# EAGLE design inverter (EAGLE 6.6.0)
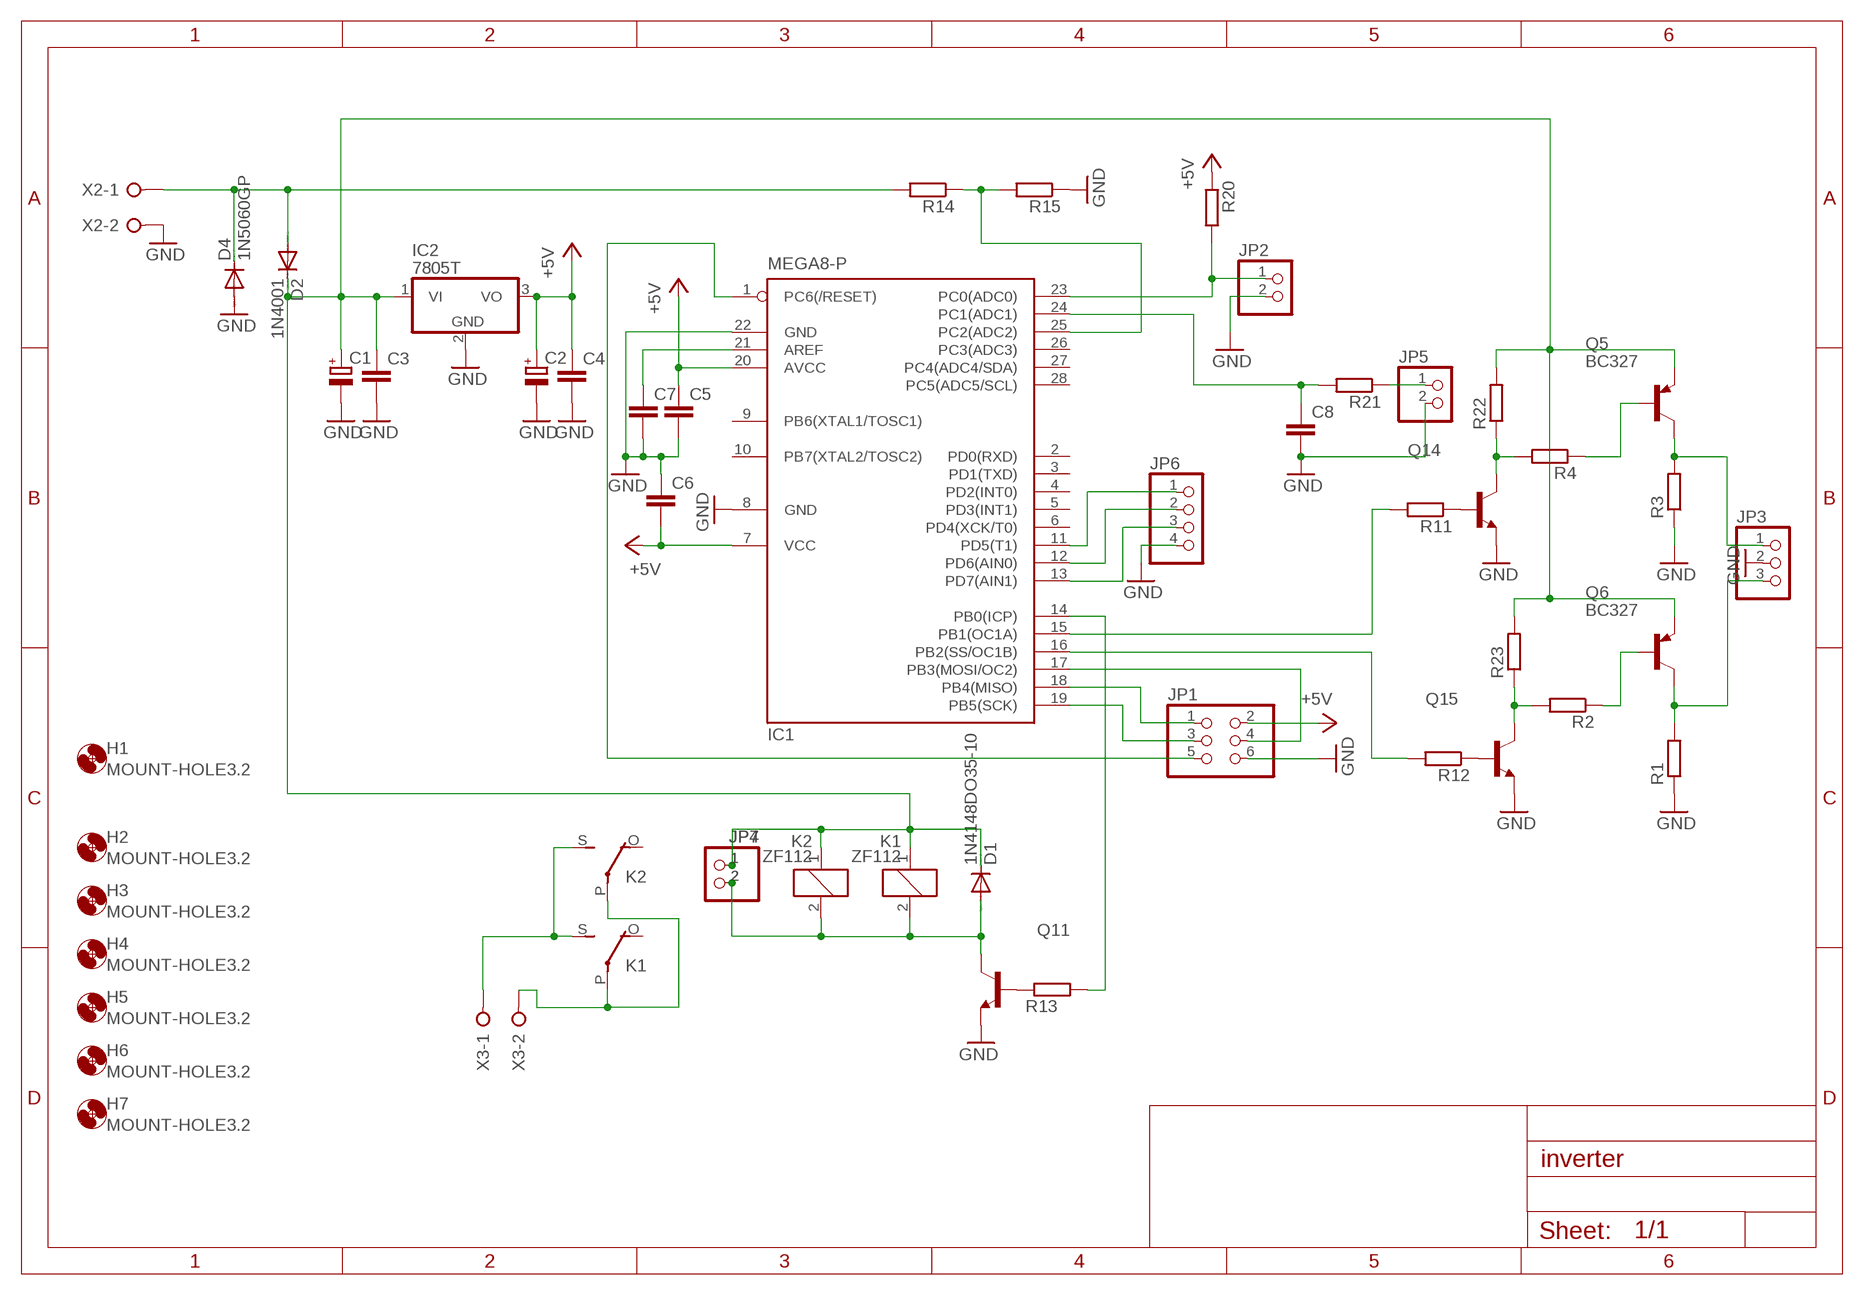
[diagram p0: schematic, sheet 1]

## Parts
C1  CPOL-EUE7.5-16  [E7,5-16]
C2  CPOL-EUE2.5-6  [E2,5-6]
C3  C-EU050-025X075  [C050-025X075]
C4  C-EU050-025X075  [C050-025X075]
C5  C-EU050-025X075  [C050-025X075]
C6  C-EU050-025X075  [C050-025X075]
C7  C-EU050-025X075  [C050-025X075]
C8  C-EU050-025X075  [C050-025X075]
D1  1N4148DO35-10  [DO35-10]
D2  1N4001  1N4148DO35-10  [DO35-10]
D4  1N5060GP  [DO15-12]
H1  MOUNT-HOLE3.2  [3,2]
H2  MOUNT-HOLE3.2  [3,2]
H3  MOUNT-HOLE3.2  [3,2]
H4  MOUNT-HOLE3.2  [3,2]
H5  MOUNT-HOLE3.2  [3,2]
H6  MOUNT-HOLE3.2  [3,2]
H7  MOUNT-HOLE3.2  [3,2]
IC1  MEGA8-P  [DIL28-3]
IC2  7805T  [TO220H]
JP1  PINHD-2X3  [2X03]
JP2  PINHD-1X2  [1X02]
JP3  PINHD-1X3  [1X03]
JP4  PINHD-1X2  [1X02]
JP5  PINHD-1X2  [1X02]
JP6  PINHD-1X4  [1X04]
JP7  PINHD-1X2  [1X02]
K1  ZF112  [ZF112]
K2  ZF112  [ZF112]
Q5  BC327  [TO92-EBC]
Q6  BC327  [TO92-EBC]
Q11  BC547-NPN-TO92-CBE  [TO92-CBE]
Q14  BC547-NPN-TO92-CBE  [TO92-CBE]
Q15  BC547-NPN-TO92-CBE  [TO92-CBE]
R1  R-EU_0207/5V  [0207/5V]
R2  R-EU_0207/2V  [0207/2V]
R3  R-EU_0207/5V  [0207/5V]
R4  R-EU_0207/2V  [0207/2V]
R11  R-EU_0207/5V  [0207/5V]
R12  R-EU_0207/5V  [0207/5V]
R13  R-EU_0207/2V  [0207/2V]
R14  R-EU_0207/10  [0207/10]
R15  R-EU_0207/10  [0207/10]
R20  R-EU_0207/10  [0207/10]
R21  R-EU_0207/2V  [0207/2V]
R22  R-EU_0207/10  [0207/10]
R23  R-EU_0207/10  [0207/10]
X2  W237-02P  [W237-132]
X3  W237-02P  [W237-132]

## Nets
+5V: C2.+ C4.1 C5.1 C6.2 IC1.7(VCC) IC1.20(AVCC) IC2.3(VO) JP1.2 R20.1
GND: C1.- C2.- C3.2 C4.2 C5.2 C6.1 C7.2 C8.2 D4.A IC1.8(GND) IC1.22(GND) IC2.2(GND) JP1.6 JP2.2 JP3.2 JP5.2 JP6.4 Q11.E Q14.E Q15.E R1.1 R3.1 R15.1 X2.2
N$1: JP5.1 R21.1
N$2: Q6.B R2.1
N$3: Q5.B R4.1
N$6: JP3.1 Q5.C R3.2
N$9: IC1.25(PC2(ADC2)) R14.1 R15.2
N$10: IC1.13(PD7(AIN1)) JP6.3
N$13: JP3.3 Q6.C R1.2
N$19: Q15.C R2.2 R23.1
N$20: Q15.B R12.1
N$21: IC1.15(PB1(OC1A)) R11.2
N$22: IC1.16(PB2(SS/OC1B)) R12.2
N$24: C7.1 IC1.21(AREF)
N$25: D2.A D4.C R14.2 X2.1
N$26: C1.+ C3.1 D1.C D2.C IC2.1(VI) JP4.1 JP7.1 K1.1 K2.1 Q5.E Q6.E R22.2 R23.2
N$27: C8.1 IC1.24(PC1(ADC1)) R21.2
N$28: D1.A JP4.2 JP7.2 K1.2 K2.2 Q11.C
N$30: Q11.B R13.1
N$31: K1.P(2:P) K2.P(2:P) X3.2
N$33: IC1.12(PD6(AIN0)) JP6.2
N$34: IC1.18(PB4(MISO)) JP1.1
N$35: IC1.19(PB5(SCK)) JP1.3
N$36: IC1.17(PB3(MOSI/OC2)) JP1.4
N$37: IC1.1(PC6(/RESET)) JP1.5
N$38: IC1.11(PD5(T1)) JP6.1
N$39: K1.S(2:S) K2.S(2:S) X3.1
N$40: Q14.B R11.1
N$41: IC1.23(PC0(ADC0)) JP2.1 R20.2
N$42: Q14.C R4.2 R22.1
N$43: IC1.14(PB0(ICP)) R13.2
Unconnected: IC1.2(PD0(RXD)) IC1.3(PD1(TXD)) IC1.4(PD2(INT0)) IC1.5(PD3(INT1)) IC1.6(PD4(XCK/T0)) IC1.9(PB6(XTAL1/TOSC1)) IC1.10(PB7(XTAL2/TOSC2)) IC1.26(PC3(ADC3)) IC1.27(PC4(ADC4/SDA)) IC1.28(PC5(ADC5/SCL)) K1.O(2:O) K2.O(2:O)

## Library data of the parts
C1 C2 = rcl:CPOL-EU: POLARIZED CAPACITOR, European symbol
C3-C8 = rcl:C-EU: CAPACITOR, European symbol
D1 D2 = diode:1N4148: DIODE high speed (Philips)
D4 = diode:1N5060GP: DIODE controlled avalanche rectifier
H1-H7 = holes:MOUNT-HOLE: MOUNTING HOLE with drill center marker
IC1 = atmel:MEGA8-P: MICROCONTROLLER 8 Kbytes FLASH, 1 kbytes SRAM, 512 bytes EEPROM, USART, 4-channel 10 bit ADC, 2-channel 8 bit ADC Pin compatible with Atmega48, ATMega88, ATMega168 Source: avr.lbr; OC_FARNELL: unknown; OC_NEWARK: unknown
IC2 = linear:78*: Positive VOLTAGE REGULATOR Source: http://cache.national.com/ds/LM/LM78L05.pdf http://www.fairchildsemi.com/ds/LM/LM7805.pdf
JP1 = pinhead:PINHD-2X3: PIN HEADER
JP2 JP4 JP5 JP7 = pinhead:PINHD-1X2: PIN HEADER
JP3 = pinhead:PINHD-1X3: PIN HEADER
JP6 = pinhead:PINHD-1X4: PIN HEADER
K1 K2 = relay:ZF112: RELAY 1 x switch; OC_FARNELL: unknown; OC_NEWARK: unknown
Q5 Q6 = transistor-pnp:BC327*: PNP Transistror
Q11 Q14 Q15 = transistor:*-NPN-: NPN Transistror BF959 corrected 2008.03.06
R1-R4 R11-R15 R20-R23 = resistor:R-EU_: RESISTOR, European symbol
X2 X3 = con-wago-508:W237-02P: WAGO SREW CLAMP; OC_FARNELL: unknown; OC_NEWARK: unknown

## Board
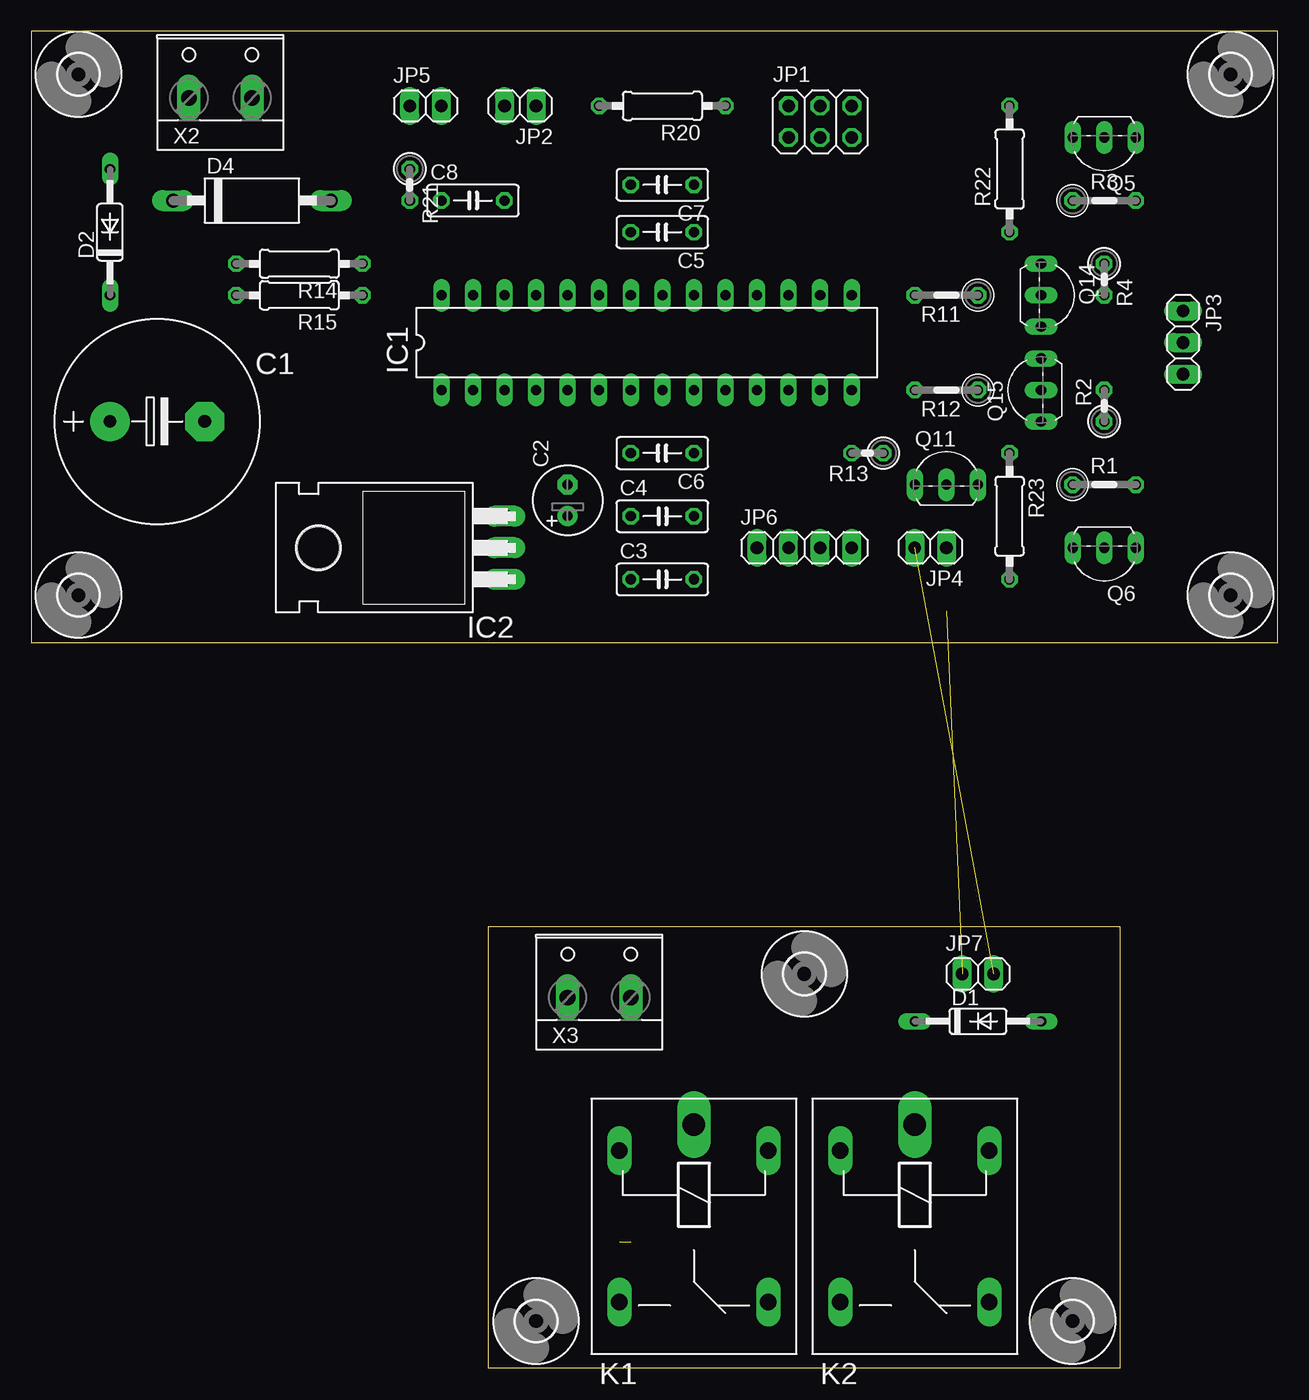
[diagram p1: board, top side]
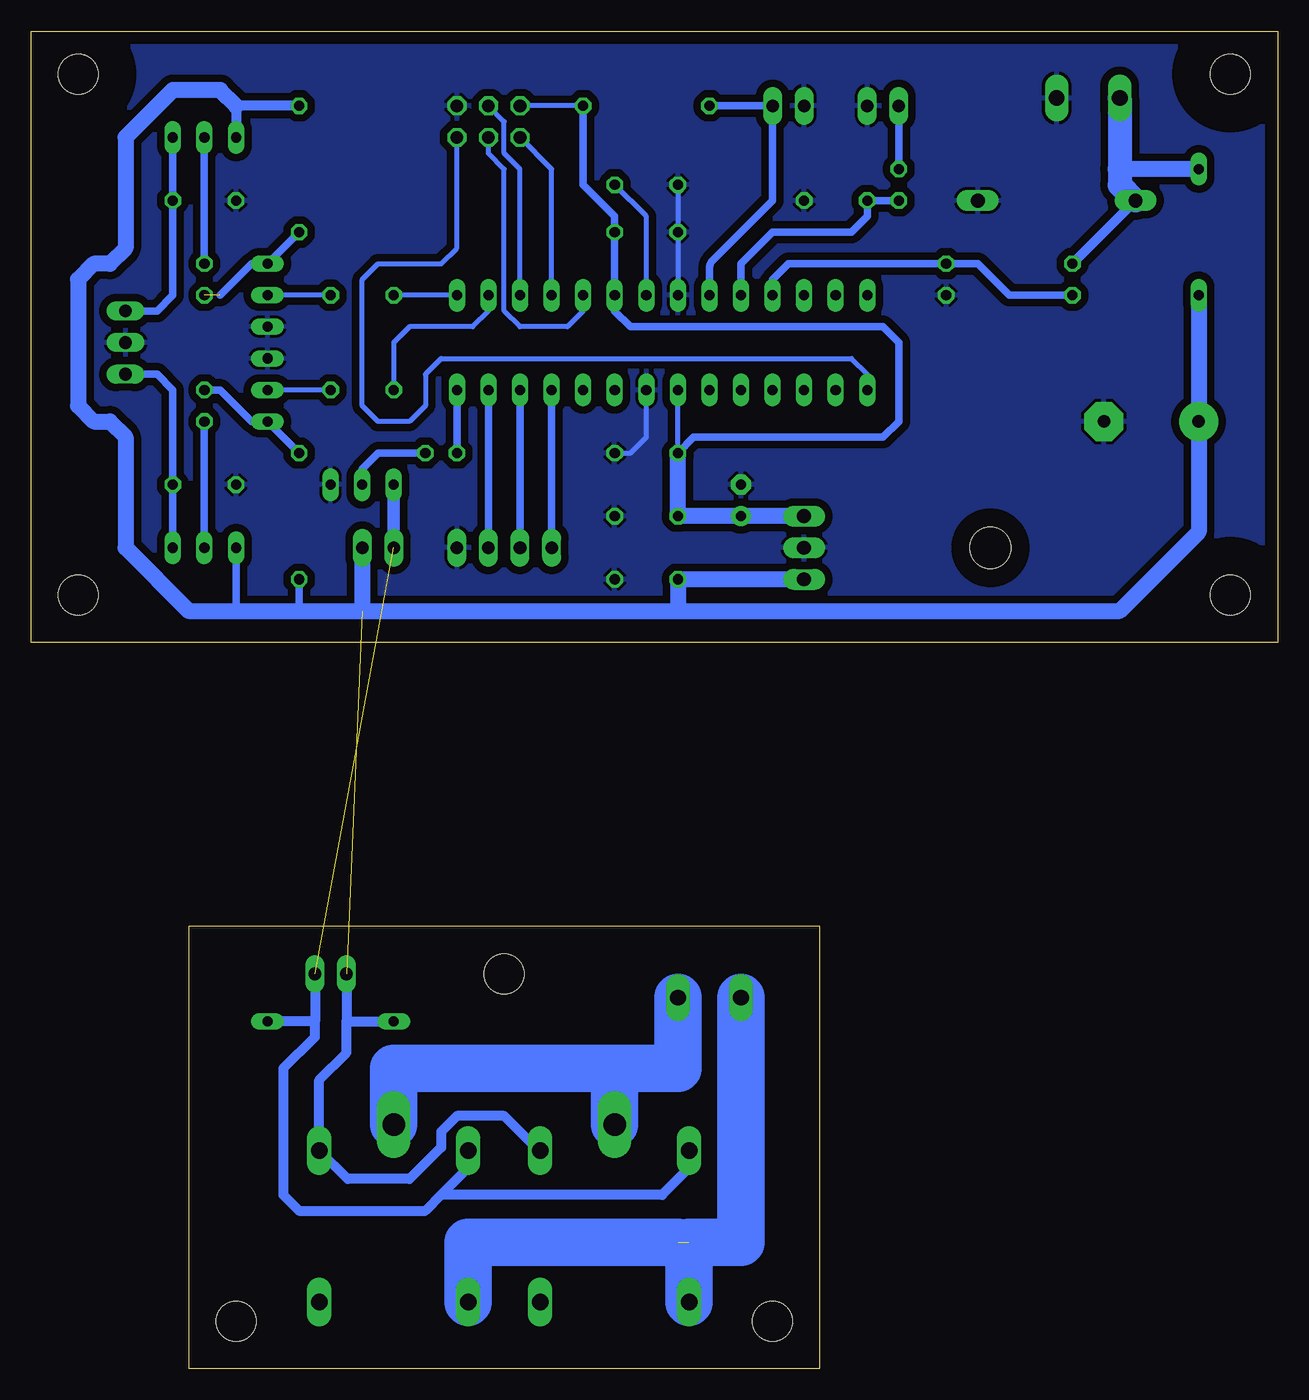
[diagram p2: board, bottom side, seen from below]

Size 100.31 x 107.62 mm. Coordinates in mm from the lower left corner, seen from the top.
Outline: 0,58.42 100.31,58.42 100.31,107.62 0,107.62 0,58.42
Outline: 36.83,35.56 87.63,35.56 87.63,0 36.83,0 36.83,35.56
Copper layers (1*16): Top 0.035mm / dielectric 1.5mm / Bottom 0.035mm
Design rules "default": minimum track width 10mil, minimum drill 24mil, track to track 8mil, track to pad 8mil, pad to pad 8mil, via to via 8mil, smd to smd 8mil, copper to edge 40mil, drill to drill 8mil, minimum pad ring 10mil, minimum via ring 8mil, stop-mask expansion 4mil, vias tented up to drill 0mil, thermal gap 10mil

### Footprints (pad centres in the part's own frame; a part is rotated, then mirrored left to right if it is on the bottom)
E7,5-16 = drill 1.016 pad 3.15: + -3.81,0 | drill 1.016 pad 3.15 octagon: - 3.81,0
E2,5-6 = drill 0.813 pad 1.6: + -1.27,0 | drill 0.813 pad 1.6 octagon: - 1.27,0
C050-025X075 = drill 0.813 octagon: 1 -2.54,0; 2 2.54,0
DO35-10 = drill 0.813 long: A 5.08,0; C -5.08,0
DO15-12 = drill 1.118 long: A 6.35,0; C -6.35,0
3,2 = hole 3.2: 0,0
DIL28-3 = drill 0.813 long: 1 -16.51,-3.81; 2 -13.97,-3.81; 3 -11.43,-3.81; 4 -8.89,-3.81; 5 -6.35,-3.81; 6 -3.81,-3.81; 7 -1.27,-3.81; 8 1.27,-3.81; 9 3.81,-3.81; 10 6.35,-3.81; 11 8.89,-3.81; 12 11.43,-3.81; 13 13.97,-3.81; 14 16.51,-3.81; 15 16.51,3.81; 16 13.97,3.81; 17 11.43,3.81; 18 8.89,3.81; 19 6.35,3.81; 20 3.81,3.81; 21 1.27,3.81; 22 -1.27,3.81; 23 -3.81,3.81; 24 -6.35,3.81; 25 -8.89,3.81; 26 -11.43,3.81; 27 -13.97,3.81; 28 -16.51,3.81
TO220H = drill 1.118 long: 1 -2.54,-10.16; 2 0,-10.16; 3 2.54,-10.16 | hole 3.302: 0,4.826
2X03 = drill 1.016 octagon: 1 -2.54,-1.27; 2 -2.54,1.27; 3 0,-1.27; 4 0,1.27; 5 2.54,-1.27; 6 2.54,1.27
1X02 = drill 1.016 long: 1 -1.27,0; 2 1.27,0
1X03 = drill 1.016 long: 1 -2.54,0; 2 0,0; 3 2.54,0
1X04 = drill 1.016 long: 1 -3.81,0; 2 -1.27,0; 3 1.27,0; 4 3.81,0
ZF112 = drill 1.321 long: 1 -6.096,5.994; 2 -6.096,-5.994; O 6.096,5.994; S 6.096,-5.994 | drill 1.803 long: P -8.204,0
TO92-EBC = drill 0.813 long: B 0,-1.27; C -2.54,-1.27; E 2.54,-1.27
TO92-CBE = drill 0.813 long: B 0,0; C -2.54,0; E 2.54,0
0207/5V = drill 0.813 octagon: 1 -2.54,0; 2 2.54,0
0207/2V = drill 0.813 octagon: 1 -1.27,0; 2 1.27,0
0207/10 = drill 0.813 octagon: 1 -5.08,0; 2 5.08,0
W237-132 = drill 1.27 long: 1 -2.54,-0.635; 2 2.54,-0.635

### Placement (x,y rotation side)
C1  10.16,76.2 0 top
C2  43.18,69.85 90 top
C3  50.8,63.5 0 top
C4  50.8,68.58 0 top
C5  50.8,91.44 180 top
C6  50.8,73.66 180 top
C7  50.8,95.25 180 top
C8  35.56,93.98 0 top
D1  76.2,27.94 0 top
D2  6.35,91.44 90 top
D4  17.78,93.98 0 top
H1  96.52,62.23 0 top
H2  96.52,104.14 0 top
H3  3.81,104.14 0 top
H4  3.81,62.23 0 top
H5  40.64,3.81 0 top
H6  83.82,3.81 0 top
H7  62.23,31.75 0 top
IC1  49.53,82.55 0 top
IC2  27.94,66.04 90 top
JP1  63.5,100.33 0 top
JP2  39.37,101.6 180 top
JP3  92.71,82.55 270 top
JP4  72.39,66.04 180 top
JP5  31.75,101.6 0 top
JP6  62.23,66.04 0 top
JP7  76.2,31.75 0 top
K1  53.34,11.43 270 top
K2  71.12,11.43 270 top
Q5  86.36,97.79 180 top
Q6  86.36,64.77 180 top
Q11  73.66,71.12 0 top
Q14  81.28,86.36 270 top
Q15  81.28,78.74 90 top
R1  86.36,71.12 0 top
R2  86.36,77.47 90 top
R3  86.36,93.98 0 top
R4  86.36,87.63 270 top
R11  73.66,86.36 180 top
R12  73.66,78.74 180 top
R13  67.31,73.66 180 top
R14  21.59,88.9 180 top
R15  21.59,86.36 180 top
R20  50.8,101.6 180 top
R21  30.48,95.25 270 top
R22  78.74,96.52 90 top
R23  78.74,68.58 270 top
X2  15.24,102.87 0 top
X3  45.72,30.48 0 top

### Tracks (layer width: path | path; a pad name or v marks a point on that pad's centre or on a via)
+5V
  Bottom 0.406: C6.2 IC1.7 | R20.1 JP1.2
  Bottom 0.61: R20.1 55.88,95.25 53.34,92.71 C5.1 IC1.20 53.34,85.09 52.07,83.82 31.75,83.82 30.48,82.55 30.48,76.2 31.75,74.93 46.99,74.93 C6.2
  Bottom 1.27: IC2.3 C2.+ C4.1 C6.2
GND
  Bottom 0.406: C7.2 C5.2 IC1.22 | C6.1 52.07,73.66 50.8,74.93 IC1.8
  pour Bottom (isolate 0.61): -2.54,109.22 102.87,109.22 102.87,52.07 -2.54,52.07
N$1
  Bottom 0.61: JP5.1 R21.1
N$2
  Bottom 0.61: R2.1 Q6.B
N$3
  Bottom 0.61: R4.1 Q5.B
N$6
  Bottom 0.61: JP3.1 90.17,85.09 88.9,86.36 R3.2 Q5.C
N$9
  Bottom 0.61: IC1.25 40.64,87.63 39.37,88.9 R14.1 24.13,88.9 21.59,86.36 R15.2
N$10
  Bottom 0.61: IC1.13 JP6.3
N$13
  Bottom 0.61: JP3.3 90.17,80.01 88.9,78.74 R1.2 88.9,69.85 Q6.C
N$19
  Bottom 0.61: R23.1 Q15.C 82.55,76.2 85.09,78.74 R2.2
N$20
  Bottom 0.406: R12.1 Q15.B
N$21
  Bottom 0.406: IC1.15 R11.2
N$22
  Bottom 0.406: IC1.16 63.5,85.09 64.77,83.82 69.85,83.82 71.12,82.55 R12.2
N$24
  Bottom 0.406: IC1.21 50.8,92.71 C7.1
N$25
  Bottom 0.813: D4.C R14.2
  Bottom 1.27: D2.A 12.7,96.52
  Bottom 1.93: X2.1 12.7,96.52 12.7,95.25 D4.C
N$26  (1 unrouted)
  Bottom 0.61: R23.2 78.74,60.96 | Q6.E 83.82,60.96
  Bottom 0.813: 74.93,27.94 D1.C | K1.1 59.44,17.53 62.23,20.32 66.04,20.32 67.31,19.05 67.31,17.78 69.85,15.24 74.83,15.24 K2.1 77.11,23.22 74.93,25.4 74.93,27.94 | JP7.1 74.93,27.94 | Q5.E 83.82,101.6 R22.2
  Bottom 1.27: D2.C C1.+ 6.35,67.31 12.7,60.96 48.26,60.96 | 83.82,101.6 85.09,102.87 88.9,102.87 92.71,99.06 92.71,90.17 93.98,88.9 95.25,88.9 96.52,87.63 96.52,77.47 95.25,76.2 93.98,76.2 92.71,74.93 92.71,66.04 87.63,60.96 83.82,60.96 78.74,60.96 73.66,60.96 | 73.66,60.96 48.26,60.96 | 48.26,60.96 C3.1 IC2.1 | JP4.1 73.66,60.96
N$27
  Bottom 0.61: IC1.24 43.18,88.9 40.64,91.44 34.29,91.44 33.02,92.71 C8.1 R21.2
N$28  (1 unrouted)
  Bottom 0.813: K2.2 65.13,16.15 67.31,13.97 | K1.2 47.35,16.15 49.53,13.97 67.31,13.97 | 67.31,13.97 68.58,12.7 78.74,12.7 80.01,13.97 80.01,24.13 77.47,26.67 77.47,27.94 | JP7.2 77.47,27.94 | 77.47,27.94 D1.A
  Bottom 1.016: Q11.C JP4.2
N$30
  Bottom 0.61: R13.1 72.39,73.66 73.66,72.39 Q11.B
N$31
  Bottom 3.81: 53.34,24.13 K1.P | K2.P 71.12,24.13 54.61,24.13 53.34,24.13 | X3.2 48.26,24.13 53.34,24.13
N$33
  Bottom 0.61: IC1.12 JP6.2
N$34
  Bottom 0.406: IC1.18 58.42,96.52 JP1.1
N$35
  Bottom 0.406: IC1.19 55.88,85.09 57.15,83.82 60.96,83.82 62.23,85.09 62.23,96.52 63.5,97.79 JP1.3
N$36
  Bottom 0.406: IC1.17 60.96,96.52 62.23,97.79 62.23,100.33 JP1.4
N$37
  Bottom 0.406: IC1.1 33.02,80.01 34.29,81.28 67.31,81.28 68.58,80.01 68.58,77.47 69.85,76.2 72.39,76.2 73.66,77.47 73.66,87.63 72.39,88.9 67.31,88.9 66.04,90.17 JP1.5
N$38
  Bottom 0.61: IC1.11 JP6.1
N$39  (1 unrouted)
  Bottom 3.81: K2.S 65.13,10.16 48.26,10.16 | K1.S 47.35,10.16 43.18,10.16 X3.1
N$40
  Bottom 0.406: R11.1 Q14.B
N$41
  Bottom 0.61: R20.2 JP2.1 40.64,93.98 45.43,89.19 arc-45 45.72,88.49 IC1.23
N$42  (1 unrouted)
  Bottom 0.61: 85.09,86.36 82.55,88.9 Q14.C R22.1
N$43
  Bottom 0.61: IC1.14 R13.2